# Altium schematic sheet Nose Poke.SchDoc
size 297 x 209 mm; CompanyName: Sainsbury Wellcome Centre; Organization: FabLab; Address1: Sainsbury Wellcome Centre; Address2: 25 Howland Street; Address3: London; Address4: W1T 4JG; DocumentNumber: 2; SheetNumber: 3; SheetTotal: 5; swcgroup: FabLab; Org: Sainsbury Wellcome Centre; Add1: 25 Howland Street; Add2: London; Add3: W1T 4JG; WebAddress: www.sainsburywellcome.org; SheetSize: A4; SheetName: Nose Poke
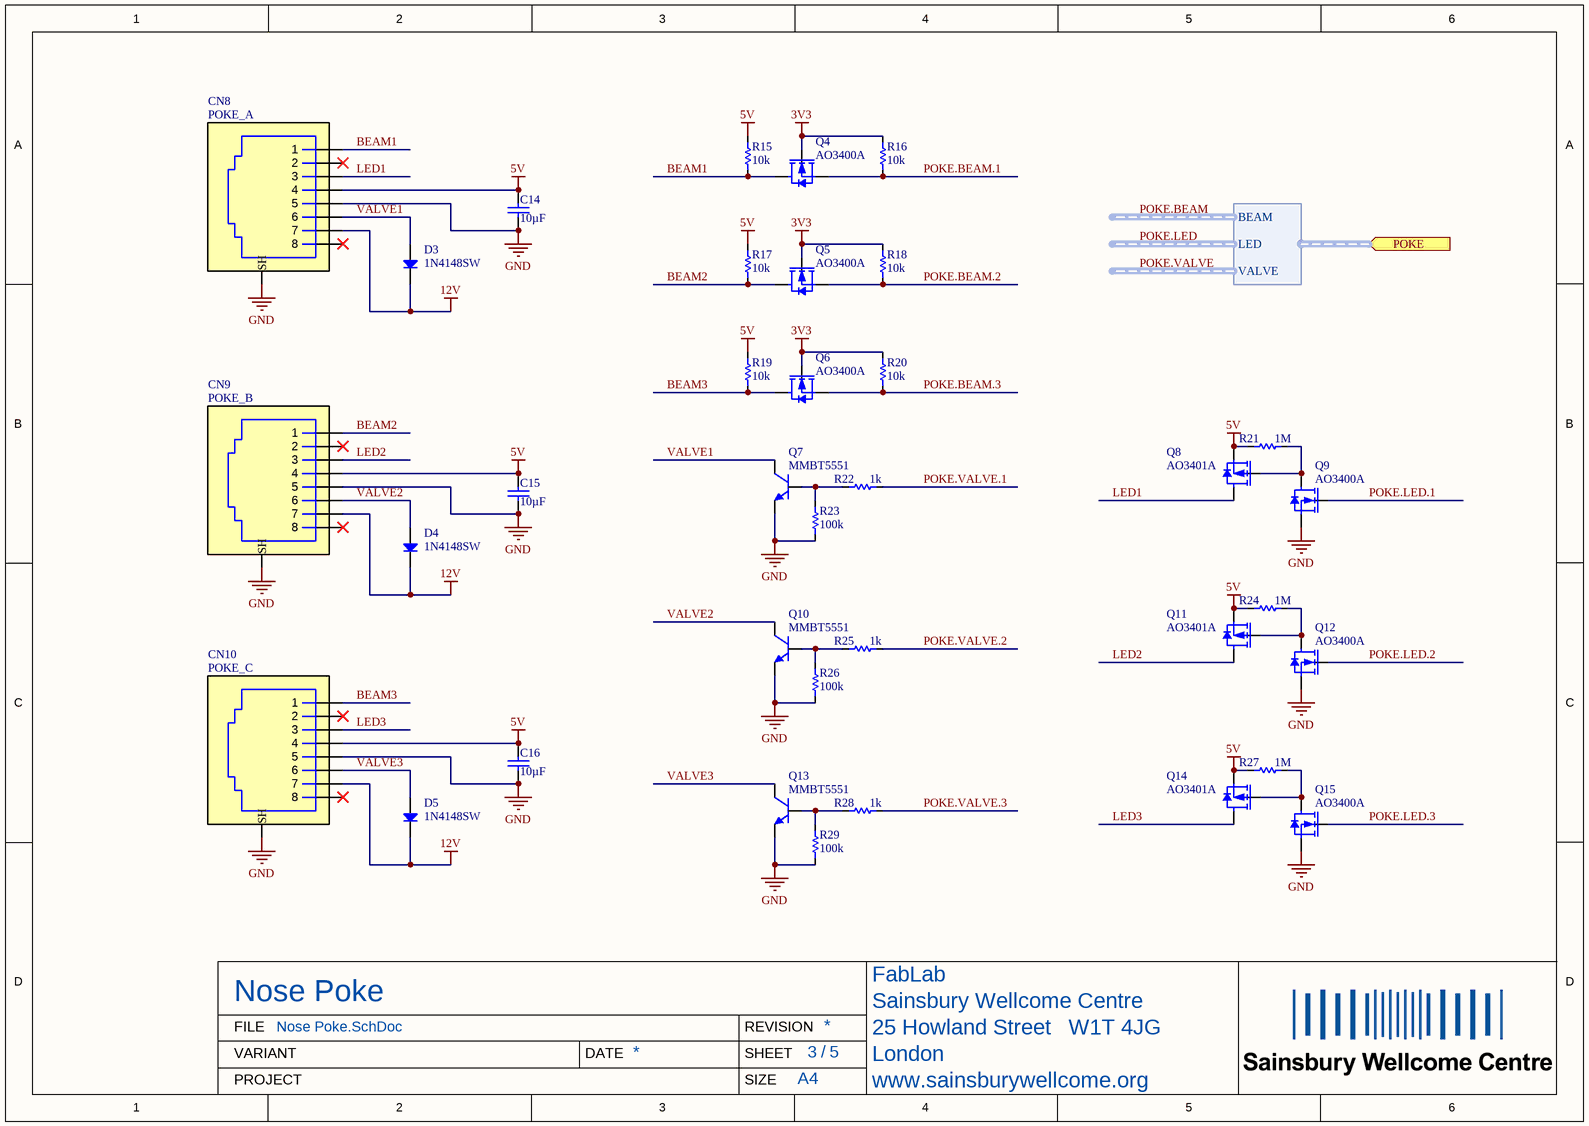
[diagram p0: Nose Poke.SchDoc]

## Parts
C14  value 10µF  [CAP_CHIP_0603]  (hidden comment: C0603-10uF-25V)
C15  value 10µF  [CAP_CHIP_0603]  (hidden comment: C0603-10uF-25V)
C16  value 10µF  [CAP_CHIP_0603]  (hidden comment: C0603-10uF-25V)
CN8  POKE_A  [6339160-1]
CN9  POKE_B  [6339160-1]
CN10  POKE_C  [6339160-1]
D3  1N4148SW  [SOD323]
D4  1N4148SW  [SOD323]
D5  1N4148SW  [SOD323]
Q4  AO3400A  [SOT23]
Q5  AO3400A  [SOT23]
Q6  AO3400A  [SOT23]
Q7  MMBT5551  [SOT23]
Q8  AO3401A  [SOT23]
Q9  AO3400A  [SOT23]
Q10  MMBT5551  [SOT23]
Q11  AO3401A  [SOT23]
Q12  AO3400A  [SOT23]
Q13  MMBT5551  [SOT23]
Q14  AO3401A  [SOT23]
Q15  AO3400A  [SOT23]
R15  value 10k  [RES_CHIP_0603]  (hidden comment: R0603-10K)
R16  value 10k  [RES_CHIP_0603]  (hidden comment: R0603-10K)
R17  value 10k  [RES_CHIP_0603]  (hidden comment: R0603-10K)
R18  value 10k  [RES_CHIP_0603]  (hidden comment: R0603-10K)
R19  value 10k  [RES_CHIP_0603]  (hidden comment: R0603-10K)
R20  value 10k  [RES_CHIP_0603]  (hidden comment: R0603-10K)
R21  value 1M  [RES_CHIP_0603]  (hidden comment: R0603-1M)
R22  value 1k  [RES_CHIP_0603]  (hidden comment: R0603-1K)
R23  value 100k  [RES_CHIP_0603]  (hidden comment: R0603-100K)
R24  value 1M  [RES_CHIP_0603]  (hidden comment: R0603-1M)
R25  value 1k  [RES_CHIP_0603]  (hidden comment: R0603-1K)
R26  value 100k  [RES_CHIP_0603]  (hidden comment: R0603-100K)
R27  value 1M  [RES_CHIP_0603]  (hidden comment: R0603-1M)
R28  value 1k  [RES_CHIP_0603]  (hidden comment: R0603-1K)
R29  value 100k  [RES_CHIP_0603]  (hidden comment: R0603-100K)

## Ports
POKE (in, harness POKE)

## Harnesses
POKE: VALVE, LED, BEAM

## Nets
3V3: Q4.1(G) Q5.1(G) Q6.1(G) R16.2 R18.2 R20.2
5V: C14.2 C15.2 C16.2 CN8.4 CN9.4 CN10.4 Q8.2(S) Q11.2(S) Q14.2(S) R15.2 R17.2 R19.2 R21.2 R24.2 R27.2
12V: CN8.7 CN9.7 CN10.7 D3.1(K) D4.1(K) D5.1(K)
GND: C14.1 C15.1 C16.1 CN8.0(SH) CN8.5 CN9.0(SH) CN9.5 CN10.0(SH) CN10.5 Q7.2(E) Q9.2(S) Q10.2(E) Q12.2(S) Q13.2(E) Q15.2(S) R23.1 R26.1 R29.1
BEAM1: CN8.1 Q4.3(D) R15.1
BEAM2: CN9.1 Q5.3(D) R17.1
BEAM3: CN10.1 Q6.3(D) R19.1
LED1: CN8.3 Q8.3(D)
LED2: CN9.3 Q11.3(D)
LED3: CN10.3 Q14.3(D)
POKE.BEAM.1: Q4.2(S) R16.1
POKE.BEAM.2: Q5.2(S) R18.1
POKE.BEAM.3: Q6.2(S) R20.1
POKE.LED.1: Q9.1(G)
POKE.LED.2: Q12.1(G)
POKE.LED.3: Q15.1(G)
POKE.VALVE.1: R22.2
POKE.VALVE.2: R25.2
POKE.VALVE.3: R28.2
VALVE1: CN8.6 D3.2(A) Q7.3(C)
VALVE2: CN9.6 D4.2(A) Q10.3(C)
VALVE3: CN10.6 D5.2(A) Q13.3(C)
NetQ7_1: Q7.1(B) R22.1 R23.2
NetQ8_1: Q8.1(G) Q9.3(D) R21.1
NetQ10_1: Q10.1(B) R25.1 R26.2
NetQ11_1: Q11.1(G) Q12.3(D) R24.1
NetQ13_1: Q13.1(B) R28.1 R29.2
NetQ14_1: Q14.1(G) Q15.3(D) R27.1

Not connected (* = marked no-connect by the designer): CN8 2* 8*; CN9 2* 8*; CN10 2* 8*

## Notes on the sheet
- FILE
- VARIANT
- DATE
- REVISION
- SHEET
- /
- PROJECT
- SIZE

## Library data of the parts
C14-C16 = CMP-611-0050-6: 0603 Multilayer Ceramic Capacitors MLCC; PartNumber: CL10A106MA8NRNC; Dielectric: X5R; Pick&PlaceFootprint: C0603; Voltage Rating: 25V; Tolerance: 20%; Case/Package: 0603; LCSC Part N.: C96446; RoHS: Yes; Capacitor Type: Ceramic; Mount: SMD
CN8-CN10 = CMP-390-0000-8: CONN MOD JACK 8P8C R/A SHIELDED; Number of Contacts: 8; Pitch: 1.02mm; Element Configuration: Single; Gender: Female; LCSC Part N.: C125076; Orientation: Right Angle; PartNumber: 6339160-1; Termination: SMD/SMT; Shielding: Shielded
D3-D5 = CMP-820-0007-2: 100V Single 1.25V@150mA 4ns 150mA SOD-323 Switching Diode; Forward Voltage: 1.25V; Mount: Surface Mount; Max Reverse Voltage: 100V; Pick&PlaceFootprint: SOD-323; Rectified Current: 150mA; LCSC Part N.: C2128; PartNumber: 1N4148SW
Q4-Q6 Q9 Q12 Q15 = CMP-810-0002-2: 30V 5.7A 26.5mΩ@10V,5.7A 1.4W 1.5V@250uA 1 NChannel SOT-23-3L MOSFETs; Gate-Source Voltage (Vgs): 12V; Pick&PlaceFootprint: SOT-23; RDS(ON): 26.5mR; Switching Time: 34.5ns; LCSC Part N.: C20917; Drain-Source Voltage (Vds): 30V; Mount: Surface Mount; PartNumber: AO3400A; Power Dissipation: 1.4W; Drain Current (Id): 5.7A; Polarity: N Channel
Q7 Q10 Q13 = CMP-810-0000-7: 160V 300mW 200@10mA 5V 600mA NPN SOT-23 Bipolar Transistor; Collector-Base Voltage (VCBO): 180V; Transition Frequency: 100MHz; Emitter-Base Voltage  (VEBO): 6V; Power Dissipation: 300mW; Polarity: NPN; PartNumber: MMBT5551; Pick&PlaceFootprint: SOT-23; Collector Current (IC): 600mA; Mount: Surface Mount; LCSC Part N.: C2145; Collector-Emitter Voltage( VCEO): 160V
Q8 Q11 Q14 = CMP-810-0003-2: 30V 4A 44mΩ@10V,4.3A 1.4W 1.3V@250uA 1 PChannel SOT-23-3L MOSFETs; RDS(ON): 44mR; Gate-Source Voltage (Vgs): 12V; Pick&PlaceFootprint: SOT-23; Drain Current (Id): -4A; Switching Time: 60ns; Drain-Source Voltage (Vds): -30V; Polarity: P Channel; Power Dissipation: 1.4W; LCSC Part N.: C15127; Mount: Surface Mount; PartNumber: AO3401A
R15-R20 = CMP-633-0002-26: 100mW Thick Film Resistors 75V ±100ppm/℃ ±1% 0603 Chip Resistor; PartNumber: 0603WAF1002T5E; Number of Resistors: 1; Pick&PlaceFootprint: R0603; Case/Package: 0603; Voltage Rating: 75V; Power Rating: 100mW; LCSC Part N.: C25804; Tolerance: 1%; Mount: Surface Mount
R21 R24 R27 = CMP-633-0066-20: 100mW Thick Film Resistors 75V ±100ppm/℃ ±1% 0603 Chip Resistor; PartNumber: 0603WAF1004T5E; Number of Resistors: 1; Pick&PlaceFootprint: R0603; Voltage Rating: 75V; Mount: Surface Mount; LCSC Part N.: C22935; Power Rating: 100mW; Tolerance: 1%; Case/Package: 0603
R22 R25 R28 = CMP-633-0013-26: 100mW Thick Film Resistors 75V ±100ppm/℃ ±1% 0603 Chip Resistor; PartNumber: 0603WAF1001T5E; Pick&PlaceFootprint: R0603; Number of Resistors: 1; Voltage Rating: 75V; Case/Package: 0603; Tolerance: 1%; Mount: Surface Mount; LCSC Part N.: C21190; Power Rating: 100mW
R23 R26 R29 = CMP-633-0000-28: 100mW Thick Film Resistors 75V ±100ppm/℃ ±1% 0603 Chip Resistor; PartNumber: 0603WAF1003T5E; Number of Resistors: 1; Pick&PlaceFootprint: R0603; LCSC Part N.: C25803; Mount: Surface Mount; Voltage Rating: 75V; Power Rating: 100mW; Case/Package: 0603; Tolerance: 1%